# EAGLE board M840X (EAGLE 6.6.0), part 1 of 2
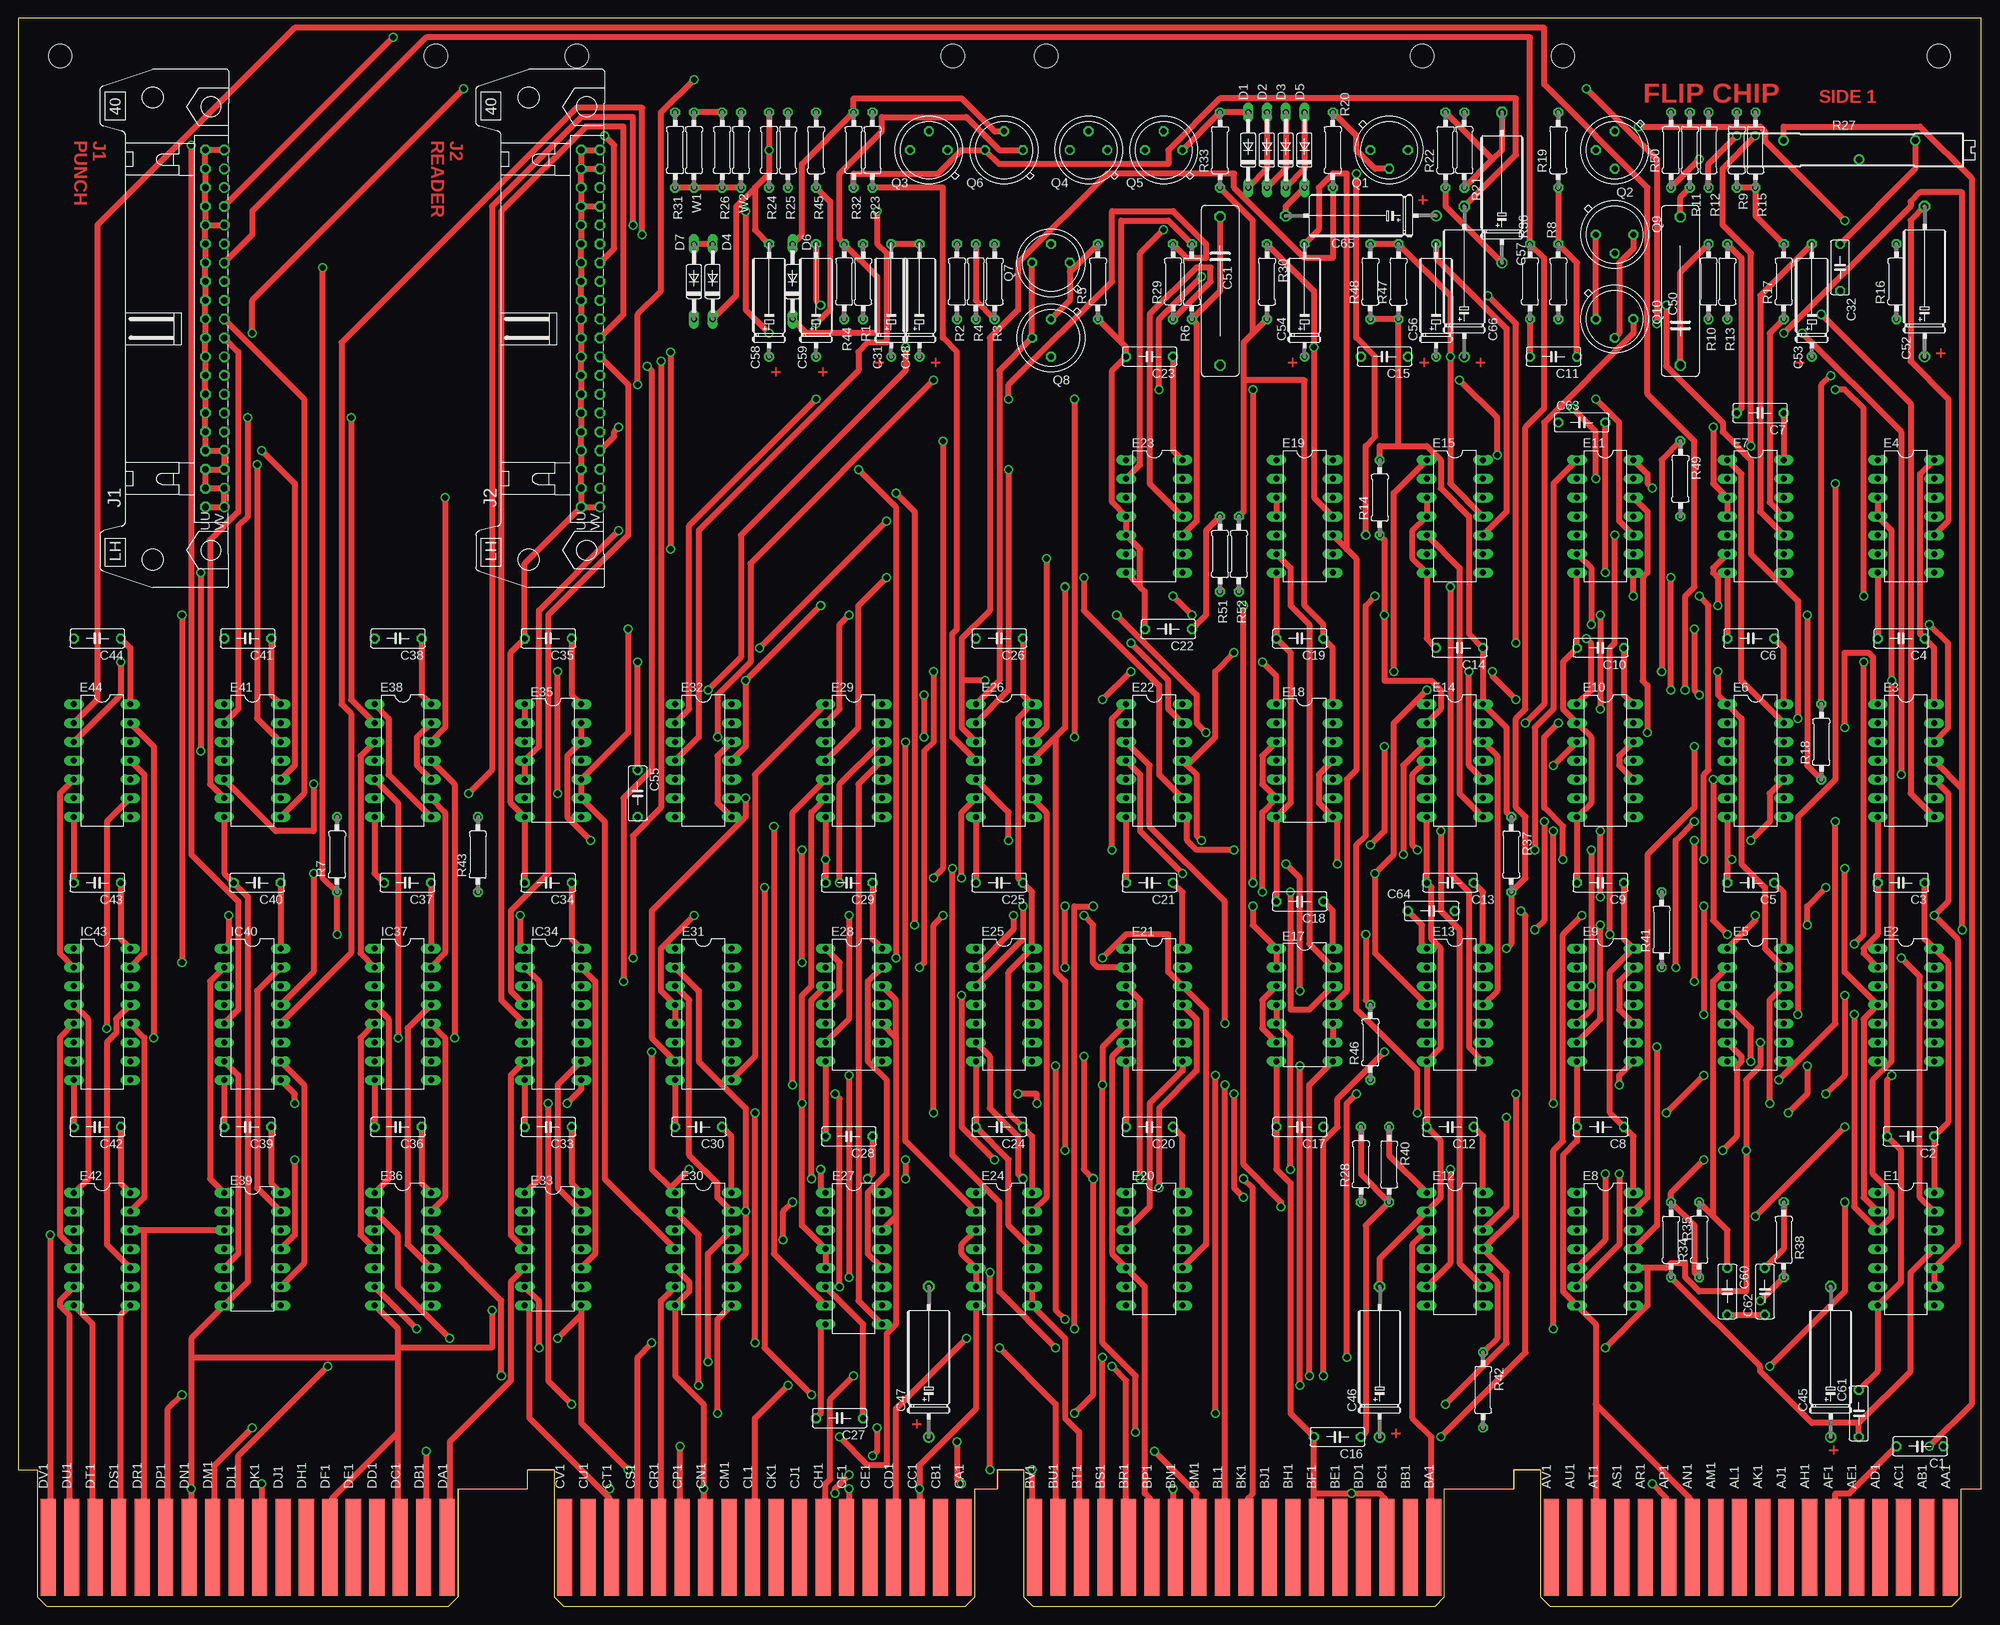
[diagram p4: board, top side]
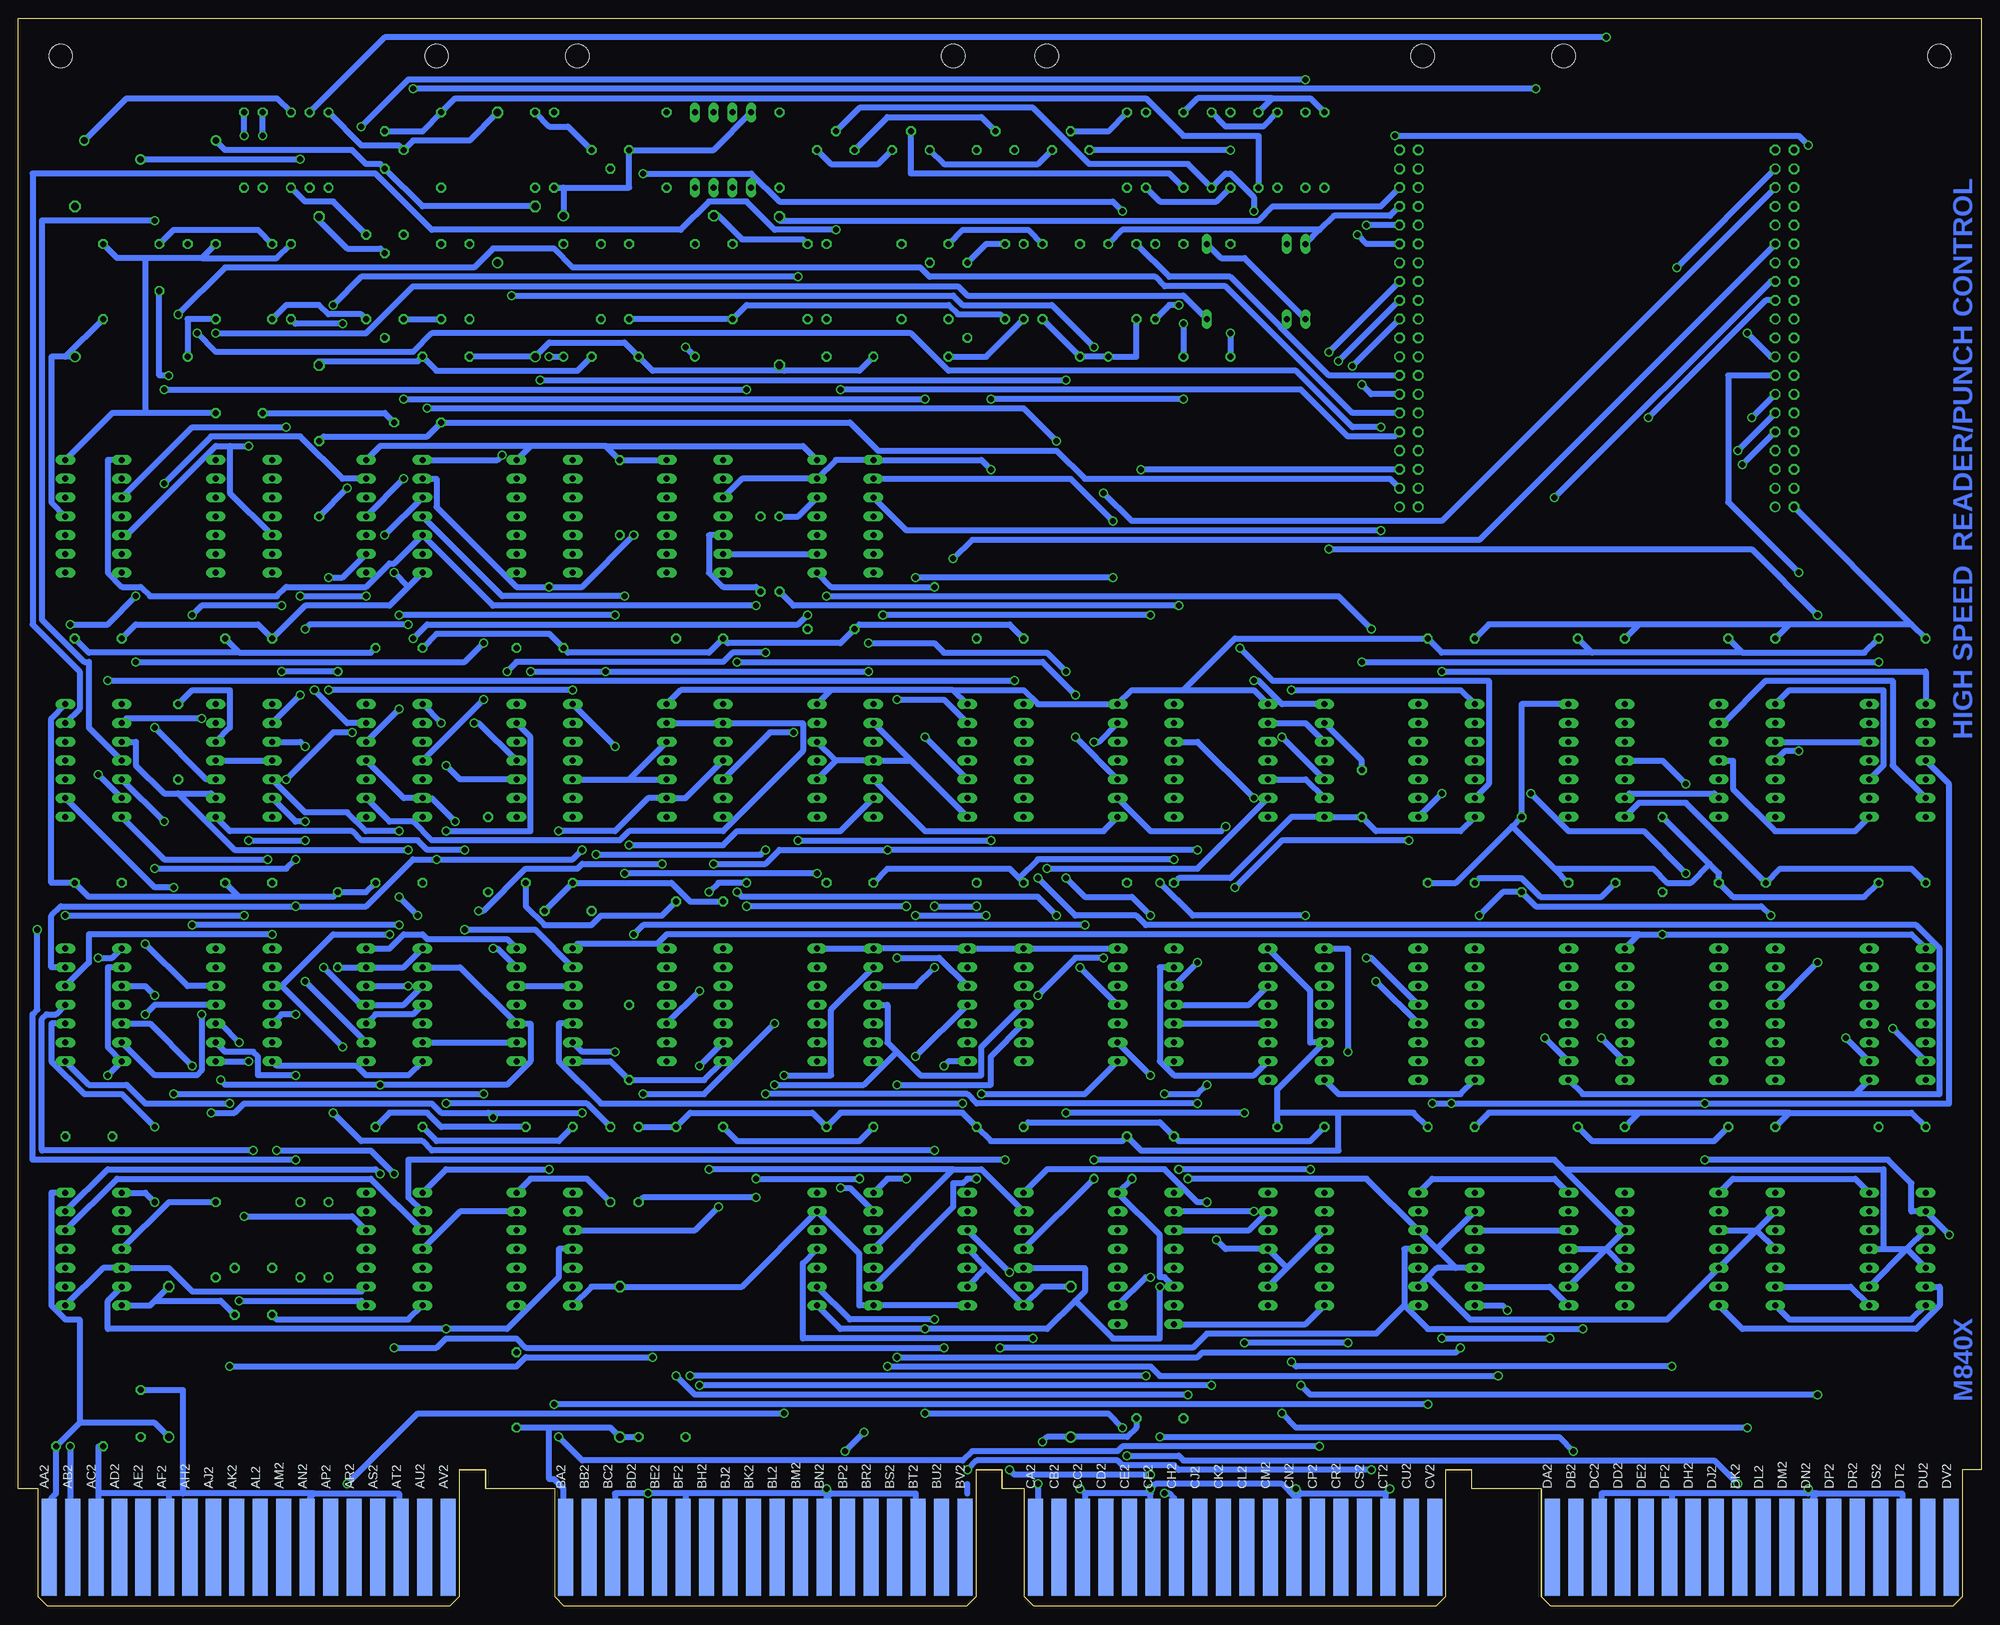
[diagram p5: board, bottom side, seen from below]

Size 265.3 x 214.63 mm. Coordinates in mm from the lower left corner, seen from the top.
Copper layers (1+2+15+16): Top 0.035mm / dielectric 1.5mm / ECO1 0.035mm / dielectric 0.15mm / ECO2 0.035mm / dielectric 0.2mm / Bottom 0.035mm
Design rules "16mils *": minimum track width 16mil, minimum drill 32mil, track to track 15mil, track to pad 10mil, pad to pad 10mil, via to via 10mil, smd to smd 10mil, copper to edge 13mil, drill to drill 10mil, minimum pad ring 10mil, minimum via ring 8mil, stop-mask expansion 0mil, vias tented up to drill 0mil, thermal gap 10mil
Net classes: 0 default: width 0.813 mm; 1 supply: width 0.813 mm

## Footprints (pad centres in the part's own frame; a part is rotated, then mirrored left to right if it is on the bottom)
C063-025X075 = drill 0.813 octagon: 1 -2.54,0; 2 3.81,0
E15-5 = drill 0.813: + -7.62,0 | drill 0.813 octagon: - 7.62,0
E12-8 = drill 1.016: + -10.16,0 | drill 1.016 octagon: - 10.16,0
C203-054-229 = drill 1.016 octagon: 1 -10.033,0; 2 10.033,0
DO35-10 = drill 0.813 long: A 5.08,0; C -5.08,0
DIL14 = drill 0.813 long: 1 -7.62,-3.81; 2 -5.08,-3.81; 3 -2.54,-3.81; 4 0,-3.81; 5 2.54,-3.81; 6 5.08,-3.81; 7 7.62,-3.81; 8 7.62,3.81; 9 5.08,3.81; 10 2.54,3.81; 11 0,3.81; 12 -2.54,3.81; 13 -5.08,3.81; 14 -7.62,3.81
DIL16 = drill 0.813 long: 1 -8.89,-3.81; 2 -6.35,-3.81; 3 -3.81,-3.81; 4 -1.27,-3.81; 5 1.27,-3.81; 6 3.81,-3.81; 7 6.35,-3.81; 8 8.89,-3.81; 9 8.89,3.81; 10 6.35,3.81; 11 3.81,3.81; 12 1.27,3.81; 13 -1.27,3.81; 14 -3.81,3.81; 15 -6.35,3.81; 16 -8.89,3.81
DEC40PINH = drill 0.914 octagon: A 24.13,1.27; AA -3.81,1.27; B 24.13,-1.27; BB -3.81,-1.27; C 21.59,1.27; CC -6.35,1.27; D 21.59,-1.27; DD -6.35,-1.27; E 19.05,1.27; EE -8.89,1.27; F 19.05,-1.27; FF -8.89,-1.27; H 16.51,1.27; HH -11.43,1.27; J 16.51,-1.27; JJ -11.43,-1.27; K 13.97,1.27; KK -13.97,1.27; L 13.97,-1.27; LL -13.97,-1.27; M 11.43,1.27; MM -16.51,1.27; N 11.43,-1.27; NN -16.51,-1.27; P 8.89,1.27; PP -19.05,1.27; R 8.89,-1.27; RR -19.05,-1.27; S 6.35,1.27; SS -21.59,1.27; T 6.35,-1.27; TT -21.59,-1.27; U 3.81,1.27; UU -24.13,1.27; V 3.81,-1.27; W 1.27,1.27; X 1.27,-1.27; Y -1.27,1.27; Z -1.27,-1.27 | drill 0.914: VV -24.13,-1.27
EDGE-CON8 = smd 2.032 x 13.106: AA1 261.303,7.938; AB1 258.127,7.938; AC1 254.952,7.938; AD1 251.778,7.938; AE1 248.602,7.938; AF1 245.428,7.938; AH1 242.252,7.938; AJ1 239.077,7.938; AK1 235.903,7.938; AL1 232.727,7.938; AM1 229.553,7.938; AN1 226.377,7.938; AP1 223.202,7.938; AR1 220.028,7.938; AS1 216.852,7.938; AT1 213.678,7.938; AU1 210.502,7.938; AV1 207.327,7.938; BA1 191.452,7.938; BB1 188.278,7.938; BC1 185.102,7.938; BD1 181.928,7.938; BE1 178.752,7.938; BF1 175.577,7.938; BH1 172.403,7.938; BJ1 169.227,7.938; BK1 166.053,7.938; BL1 162.877,7.938; BM1 159.702,7.938; BN1 156.528,7.938; BP1 153.352,7.938; BR1 150.178,7.938; BS1 147.002,7.938; BT1 143.827,7.938; BU1 140.653,7.938; BV1 137.477,7.938; CA1 127.953,7.938; CB1 124.778,7.938; CC1 121.603,7.938; CD1 118.427,7.938; CE1 115.252,7.938; CF1 112.078,7.938; CH1 108.903,7.938; CJ1 105.728,7.938; CK1 102.552,7.938; CL1 99.377,7.938; CM1 96.203,7.938; CN1 93.028,7.938; CP1 89.853,7.938; CR1 86.677,7.938; CS1 83.502,7.938; CT1 80.328,7.938; CU1 77.153,7.938; CV1 73.978,7.938; DA1 58.102,7.938; DB1 54.928,7.938; DC1 51.752,7.938; DD1 48.578,7.938; DE1 45.403,7.938; DF1 42.227,7.938; DH1 39.053,7.938; DJ1 35.877,7.938; DK1 32.703,7.938; DL1 29.527,7.938; DM1 26.352,7.938; DN1 23.177,7.938; DP1 20.003,7.938; DR1 16.828,7.938; DS1 13.652,7.938; DT1 10.477,7.938; DU1 7.303,7.938; DV1 4.128,7.938 | smd 2.032 x 13.106 bottom: AA2 261.303,7.938; AB2 258.127,7.938; AC2 254.952,7.938; AD2 251.778,7.938; AE2 248.602,7.938; AF2 245.428,7.938; AH2 242.252,7.938; AJ2 239.077,7.938; AK2 235.903,7.938; AL2 232.727,7.938; AM2 229.553,7.938; AN2 226.377,7.938; AP2 223.202,7.938; AR2 220.028,7.938; AS2 216.852,7.938; AT2 213.678,7.938; AU2 210.502,7.938; AV2 207.327,7.938; BA2 191.452,7.938; BB2 188.278,7.938; BC2 185.102,7.938; BD2 181.928,7.938; BE2 178.752,7.938; BF2 175.577,7.938; BH2 172.403,7.938; BJ2 169.227,7.938; BK2 166.053,7.938; BL2 162.877,7.938; BM2 159.702,7.938; BN2 156.528,7.938; BP2 153.352,7.938; BR2 150.178,7.938; BS2 147.002,7.938; BT2 143.827,7.938; BU2 140.653,7.938; BV2 137.477,7.938; CA2 127.953,7.938; CB2 124.778,7.938; CC2 121.603,7.938; CD2 118.427,7.938; CE2 115.252,7.938; CF2 112.078,7.938; CH2 108.903,7.938; CJ2 105.728,7.938; CK2 102.552,7.938; CL2 99.377,7.938; CM2 96.203,7.938; CN2 93.028,7.938; CP2 89.853,7.938; CR2 86.677,7.938; CS2 83.502,7.938; CT2 80.328,7.938; CU2 77.153,7.938; CV2 73.978,7.938; DA2 58.102,7.938; DB2 54.928,7.938; DC2 51.752,7.938; DD2 48.578,7.938; DE2 45.403,7.938; DF2 42.227,7.938; DH2 39.053,7.938; DJ2 35.877,7.938; DK2 32.703,7.938; DL2 29.527,7.938; DM2 26.352,7.938; DN2 23.177,7.938; DP2 20.003,7.938; DR2 16.828,7.938; DS2 13.652,7.938; DT2 10.477,7.938; DU2 7.303,7.938; DV2 4.128,7.938
TO5 = drill 0.813 octagon: 1 0,-2.54; 2 2.54,0; 3 0,2.54
0207/10 = drill 0.813 octagon: 1 -5.08,0; 2 5.08,0
3006Y = drill 0.9: 1 -8.89,1.27; 2 1.27,-1.27; 3 8.89,1.27
OMNIBUS = hole 3.175: 208.915,209.55; 259.715,209.55; 189.865,209.55; 139.065,209.55; 75.616,209.55; 126.416,209.55; 56.566,209.55; 5.766,209.55

## Placement (x,y rotation side)
C1  .01uF  [C063-025X075]  257.68,21.59 180 top
C2  .01uF  [C063-025X075]  256.41,63.5 180 top
C3  .01uF  [C063-025X075]  255.14,97.79 180 top
C4  .01uF  [C063-025X075]  255.14,130.81 180 top
C5  .01uF  [C063-025X075]  234.82,97.79 180 top
C6  .01uF  [C063-025X075]  234.82,130.81 180 top
C7  .01uF  [C063-025X075]  236.09,161.29 180 top
C8  .01uF  [C063-025X075]  214.5,64.77 180 top
C9  .01uF  [C063-025X075]  214.5,97.79 180 top
C10  .01uF  [C063-025X075]  214.5,129.54 180 top
C11  .01uF  [C063-025X075]  208.15,168.91 180 top
C12  .01uF  [C063-025X075]  194.18,64.77 180 top
C13  .01uF  [C063-025X075]  194.18,97.79 180 top
C14  .01uF  [C063-025X075]  195.45,129.54 180 top
C15  .01uF  [C063-025X075]  185.29,168.91 180 top
C16  .01uF  [C063-025X075]  178.94,22.86 180 top
C17  .01uF  [C063-025X075]  173.86,64.77 180 top
C18  .01uF  [C063-025X075]  173.86,95.25 180 top
C19  .01uF  [C063-025X075]  173.86,130.81 180 top
C20  .01uF  [C063-025X075]  153.54,64.77 180 top
C21  .01uF  [C063-025X075]  153.54,97.79 180 top
C22  680pF  [C063-025X075]  156.08,132.08 180 top
C23  .01uF  [C063-025X075]  153.54,168.91 180 top
C24  .01uF  [C063-025X075]  133.22,64.77 180 top
C25  .01uF  [C063-025X075]  133.22,97.79 180 top
C26  .01uF  [C063-025X075]  133.22,130.81 180 top
C27  .01uF  [C063-025X075]  111.63,25.4 180 top
C28  .01uF  [C063-025X075]  112.9,63.5 180 top
C29  .01uF  [C063-025X075]  112.9,97.79 180 top
C30  .01uF  [C063-025X075]  92.58,64.77 180 top
C31  OPEN  [E15-5]  117.98,176.53 90 top
C32  680pF  [C063-025X075]  246.25,180.34 90 top
C33  .01uF  [C063-025X075]  72.26,64.77 180 top
C34  .01uF  [C063-025X075]  72.26,97.79 180 top
C35  .01uF  [C063-025X075]  72.26,130.81 180 top
C36  .01uF  [C063-025X075]  51.94,64.77 180 top
C37  .01uF  [C063-025X075]  53.21,97.79 180 top
C38  .01uF  [C063-025X075]  51.94,130.81 180 top
C39  .01uF  [C063-025X075]  31.62,64.77 180 top
C40  .01uF  [C063-025X075]  32.89,97.79 180 top
C41  .01uF  [C063-025X075]  31.62,130.81 180 top
C42  .01uF  [C063-025X075]  11.3,64.77 180 top
C43  .01uF  [C063-025X075]  11.3,97.79 180 top
C44  .01uF  [C063-025X075]  11.3,130.81 180 top
C45  6.8uF  [E12-8]  244.98,33.02 90 top
C46  6.8uF  [E12-8]  184.02,33.02 90 top
C47  6.8uF  [E12-8]  123.06,33.02 90 top
C48  2.2uF  [E15-5]  121.79,176.53 90 top
C50  .01uF  [C203-054-229]  224.66,177.8 90 top
C51  .01uF  [C203-054-229]  162.43,177.8 270 top
C52  15uF  [E12-8]  257.68,179.07 90 top
C53  1uF  [E15-5]  242.44,176.53 90 top
C54  3.9uF  [E15-5]  173.86,176.53 90 top
C55  2500pF  [C063-025X075]  83.69,110.49 270 top
C56  2.2uF  [E15-5]  191.64,176.53 90 top
C57  6.8uF  [E12-8]  200.53,191.77 90 top
C58  1uF  [E15-5]  101.47,176.53 90 top
C59  1uF  [E15-5]  107.82,176.53 90 top
C60  1000pF  [C063-025X075]  231.01,43.18 270 top
C61  1500pF  [C063-025X075]  248.79,25.4 90 top
C62  680pF  [C063-025X075]  236.09,43.18 270 top
C63  330pF  [C063-025X075]  210.69,160.02 0 top
C64  330pF  [C063-025X075]  190.37,93.98 0 top
C65  39uF  [E12-8]  181.48,187.96 180 top
C66  6.8uF  [E12-8]  195.45,179.07 90 top
D1  1N914  [DO35-10]  166.24,196.85 90 top
D2  1N914  [DO35-10]  168.78,196.85 90 top
D3  1N914  [DO35-10]  171.32,196.85 90 top
D4  1N4154  [DO35-10]  93.85,179.07 90 top
D5  1N914  [DO35-10]  173.86,196.85 90 top
D6  1N4154  [DO35-10]  104.65,179.07 90 top
D7  1N4154  [DO35-10]  91.31,179.07 90 top
E1  7410N  [DIL14]  255.14,48.26 270 top
E2  7474N  [DIL14]  255.14,81.28 270 top
E3  7404N  [DIL14]  255.14,114.3 270 top
E4  74121N  [DIL14]  255.14,147.32 270 top
E5  7400N  [DIL14]  234.82,81.28 270 top
E6  7400N  [DIL14]  234.82,114.3 270 top
E7  74121N  [DIL14]  234.82,147.32 270 top
E8  7404N  [DIL14]  214.5,48.26 270 top
E9  7474N  [DIL14]  214.5,81.28 270 top
E10  7474N  [DIL14]  214.5,114.3 270 top
E11  7410N  [DIL14]  214.5,147.32 270 top
E12  7474N  [DIL14]  194.18,48.26 270 top
E13  7400N  [DIL14]  194.18,81.28 270 top
E14  7474N  [DIL14]  194.18,114.3 270 top
E15  74121N  [DIL14]  194.18,147.32 270 top
E17  7438N  [DIL14]  173.86,81.28 270 top
E18  7438N  [DIL14]  173.86,114.3 270 top
E19  74121N  [DIL14]  173.86,147.32 270 top
E20  74HCT04N  [DIL14]  153.54,48.26 270 top
E21  74HCT30N  [DIL14]  153.54,81.28 270 top
E22  7400N  [DIL14]  153.54,114.3 270 top
E23  7400N  [DIL14]  153.54,147.32 270 top
E24  74HCT02N  [DIL14]  133.22,48.26 270 top
E25  74HCT30N  [DIL14]  133.22,81.28 270 top
E26  7404N  [DIL14]  133.22,114.3 270 top
E27  74LS138N  [DIL16]  112.9,46.99 270 top
E28  7400N  [DIL14]  112.9,81.28 270 top
E29  7404N  [DIL14]  112.9,114.3 270 top
E30  74HCT02N  [DIL14]  92.58,48.26 270 top
E31  74LS138N  [DIL16]  92.58,80.01 270 top
E32  7400N  [DIL14]  92.58,114.3 270 top
E33  7438N  [DIL14]  72.26,48.26 270 top
E35  7420N  [DIL14]  72.26,114.3 270 top
E36  74HCT02N  [DIL14]  51.94,48.26 270 top
E38  7404N  [DIL14]  51.94,114.3 270 top
E39  7438N  [DIL14]  31.62,48.26 270 top
E41  7404N  [DIL14]  31.62,114.3 270 top
E42  74HCT02N  [DIL14]  11.3,48.26 270 top
E44  7404N  [DIL14]  11.3,114.3 270 top
IC34  74175N  [DIL16]  72.26,80.01 270 top
IC37  74175N  [DIL16]  51.94,80.01 270 top
IC40  74175N  [DIL16]  31.62,80.01 270 top
IC43  74175N  [DIL16]  11.3,80.01 270 top
J1  DEC40PINSH  [DEC40PINH]  26.54,172.72 90 top
J2  DEC40PINSH  [DEC40PINH]  77.34,172.72 90 top
OMNIBUS  QUAD  [EDGE-CON8]  -0.13,0 0 top
Q1  MPS6534  [TO5]  185.29,196.85 270 top
Q2  MPS6534  [TO5]  215.77,196.85 180 top
Q3  MPS6534  [TO5]  123.06,196.85 90 top
Q4  MPS6534  [TO5]  144.65,196.85 90 top
Q5  MPS6534  [TO5]  154.81,196.85 90 top
Q6  MPS6534  [TO5]  133.22,196.85 90 top
Q7  MPS6531  [TO5]  139.57,181.61 90 top
Q8  MPS6531  [TO5]  139.57,171.45 180 top
Q9  MPS6534  [TO5]  215.77,185.42 270 top
Q10  MPS6534  [TO5]  215.77,173.99 270 top
R1  220  [0207/10]  114.17,179.07 270 top
R2  4.7K  [0207/10]  126.87,179.07 90 top
R3  4.7K  [0207/10]  131.95,179.07 270 top
R4  220  [0207/10]  129.41,179.07 90 top
R5  100  [0207/10]  145.92,179.07 90 top
R6  220  [0207/10]  158.62,179.07 270 top
R7  3K  [0207/10]  43.05,101.6 90 top
R8  56  [0207/10]  208.15,179.07 90 top
R9  5.6K  [0207/10]  232.28,196.85 270 top
R10  100  [0207/10]  228.47,179.07 90 top
R11  3K  [0207/10]  225.93,196.85 270 top
R12  3K  [0207/10]  228.47,196.85 270 top
R13  150  [0207/10]  231.01,179.07 270 top
R14  3K  [0207/10]  184.02,149.86 90 top
R15  3K  [0207/10]  234.82,196.85 270 top
R16  15K  [0207/10]  253.87,179.07 90 top
R17  1.5K  [0207/10]  238.63,179.07 90 top
R18  220  [0207/10]  243.71,116.84 90 top
R19  3K  [0207/10]  208.15,196.85 270 top
R20  3K  [0207/10]  177.67,196.85 90 top
R21  680  [0207/10]  195.45,196.85 90 top
R22  3K  [0207/10]  192.91,196.85 270 top
R23  3K  [0207/10]  115.44,196.85 90 top
R24  3K  [0207/10]  101.47,196.85 90 top
R25  3K  [0207/10]  104.01,196.85 270 top
R26  3K  [0207/10]  95.12,196.85 90 top
R27  1K  [3006Y]  247.52,196.85 0 top
R28  3K  [0207/10]  181.48,59.69 90 top
R29  100  [0207/10]  156.08,179.07 90 top
R30  10K  [0207/10]  168.78,179.07 270 top
R31  3K  [0207/10]  88.77,196.85 90 top
R32  3K  [0207/10]  112.9,196.85 90 top
R33  47  [0207/10]  162.43,196.85 270 top
R34  220  [0207/10]  227.2,49.53 90 top
R35  330  [0207/10]  223.39,49.53 270 top
R36  10K  [0207/10]  204.34,179.07 90 top
R37  3K  [0207/10]  201.8,101.6 270 top
R38  220  [0207/10]  238.63,49.53 90 top
R40  3K  [0207/10]  185.29,59.69 270 top
R41  3K  [0207/10]  222.12,91.44 90 top
R42  3K  [0207/10]  197.99,29.21 270 top
R43  3K  [0207/10]  62.1,101.6 90 top
R44  75  [0207/10]  111.63,179.07 90 top
R45  3K  [0207/10]  107.82,196.85 270 top
R46  10K  [0207/10]  182.75,76.2 90 top
R47  18K  [0207/10]  186.56,179.07 270 top
R48  OPEN  [0207/10]  182.75,179.07 270 top
R49  270  [0207/10]  224.66,152.4 270 top
R50  1.5K  [0207/10]  223.39,196.85 90 top
R51  220  [0207/10]  162.43,142.24 90 top
R52  3K  [0207/10]  164.97,142.24 90 top
U$1  OUTLINE-OMNIBUS  [OMNIBUS]  -0.13,0 0 top
W1  0  [0207/10]  91.31,196.85 90 top
W2  0  [0207/10]  97.66,196.85 90 top

## Tracks (layer width: path | path; a pad name or v marks a point on that pad's centre or on a via)
!AB  (via drill 0.81)
  Top 0.813: v204.98,102.23 204.98,118.75 207.52,121.28 207.52,151.76 E11.1 | v94.49,117.47 94.49,123.19 98.93,127.64 98.93,140.97 v123.7,165.74 | v194.82,165.74 199.9,160.66 v199.9,155.57
  Bottom 0.813: E6.8 236.73,104.78 220.22,104.78 218.95,103.5 211.33,103.5 210.06,102.23 v204.98,102.23 | v94.49,117.47 E32.5 | v194.82,165.74 v123.7,165.74 | v199.9,155.57 200.53,154.94 E11.1
!BA  (via drill 0.81)
  Top 0.813: v246.89,187.32 236.09,198.12 236.09,199.39 235.46,200.03 v218.95,200.03 | v91.31,206.38 86.87,201.93 86.87,177.8 83.69,174.62 v83.69,165.1
  Bottom 0.813: E3.4 255.78,118.75 255.78,127.64 256.41,127.64 262.13,133.35 262.13,187.32 v246.89,187.32 | v218.95,200.03 212.6,206.38 v91.31,206.38 | v83.69,165.1 82.42,163.83 J2.FF
!BB  (via drill 0.81)
  Top 0.813: v240.54,120.02 240.54,135.89 234.19,142.24 234.19,154.94 230.38,158.75 230.38,160.02 222.76,167.64 v222.76,175.9 | v159.89,179.71 154.18,173.99 v154.18,164.47
  Bottom 0.813: E3.2 250.7,120.02 v240.54,120.02 | v222.76,175.9 218.95,179.71 v159.89,179.71 | v154.18,164.47 91.95,164.47 85.6,158.12 79.25,158.12 J2.LL
!C1  (via drill 0.81)
  Top 0.813: E17.8 174.5,70.48 v174.5,31.11 | v112.9,31.11 109.73,27.94 109.73,17.14 109.09,16.51 109.09,8.26 OMNIBUS.CH1
  Bottom 0.813: v112.9,31.11 v174.5,31.11
!CATCH_PULSE
  Bottom 0.813: E6.11 E6.4
!CLOCK_PULSE  (via drill 0.81)
  Top 0.813: E8.11 221.49,51.44 v221.49,75.56 | v215.77,144.78 215.77,130.18 215.14,129.54 v215.14,90.81
  Bottom 0.813: 229.74,83.82 v221.49,75.56 | E5.3 229.74,83.82 | v215.77,144.78 E11.3 | v215.14,90.81 222.76,90.81 229.74,83.82
!DATA04  (via drill 0.81)
  Top 0.813: E36.12 65.28,41.27 v65.28,31.11 | v147.83,32.38 149.73,30.48 149.73,8.26 OMNIBUS.BR1
  Bottom 0.813: E33.3 E36.12 | v65.28,31.11 111,31.11 112.27,32.38 v147.83,32.38
!DATA05  (via drill 0.81)
  Top 0.813: E33.6 70.36,41.27 v70.36,34.92 | v146.56,33.66 146.56,8.26 OMNIBUS.BS1
  Bottom 0.813: E36.8 58.29,43.18 E33.6 | v70.36,34.92 70.99,34.29 105.28,34.29 105.92,33.66 v146.56,33.66
!DATA06  (via drill 0.81)
  Top 0.813: v53.85,37.47 E36.6 | v132.59,34.92 140.21,27.3 140.21,8.26 OMNIBUS.BU1
  Bottom 0.813: v53.85,37.47 74.8,37.47 77.98,40.64 | 77.98,40.64 77.98,48.26 E33.11 | v132.59,34.92 106.55,34.92 104.65,36.83 81.79,36.83 77.98,40.64
!DATA07  (via drill 0.81)
  Top 0.813: E36.2 51.31,50.16 51.31,43.18 v58.29,36.2 | 76.07,39.37 v72.9,36.2 | E33.8 76.07,39.37 | v137.03,18.41 137.03,8.26 OMNIBUS.BV1 | v82.42,18.41 76.07,24.77 76.07,39.37
  Bottom 0.813: v72.9,36.2 v58.29,36.2 | v137.03,18.41 135.76,19.68 116.71,19.68 116.08,19.05 109.09,19.05 108.46,18.41 v82.42,18.41
!DATA08
  Top 0.813: E39.3 17.02,50.8 | 17.02,50.8 E42.12 | 17.02,50.8 17.02,8.26 OMNIBUS.DR1
!DATA09
  Top 0.813: E42.8 13.84,39.37 13.84,8.26 OMNIBUS.DS1
  Bottom 0.813: E42.8 17.65,43.18 E39.6
!DATA10
  Top 0.813: E42.6 5.59,41.27 5.59,40.64 6.86,39.37 6.86,8.26 OMNIBUS.DU1
  Bottom 0.813: E39.8 32.26,37.47 8.76,37.47 5.59,40.64 5.59,43.18 E42.6
!DATA11  (via drill 0.81)
  Top 0.813: E39.11 37.34,50.16 v37.34,60.33 | v4.32,50.16 4.32,8.26 OMNIBUS.DV1
  Bottom 0.813: v37.34,60.33 12.57,60.33 9.4,57.15 9.4,53.34 E42.2 v4.32,50.16
!ENA_PUN_BUFFR  (via drill 0.81)
  Top 0.813: v119.89,60.33 v119.89,57.78
  Bottom 0.813: 10.03,48.26 E42.5 | E42.11 13.21,48.26 | 13.21,48.26 10.03,48.26 | 10.03,48.26 E42.9 | 10.03,48.26 E42.3 | 50.67,48.26 E36.5 | E36.11 50.67,48.26 | 50.67,48.26 E36.3 56.39,59.05 | 50.67,48.26 E36.9 | v119.89,57.78 E24.4 | v119.89,60.33 57.66,60.33 56.39,59.05 | 13.21,48.26 13.21,59.05 56.39,59.05
!ENABLE
  Top 0.813: R23.1 124.97,191.77 124.97,171.45 126.87,169.54 126.87,132.08 126.24,131.44 126.24,117.47 E26.4
!INIT+EOT  (via drill 0.81)
  Top 0.813: E8.6 216.41,48.9 v216.41,58.42 | v254.51,87.63 257.05,85.09 257.05,55.24 E1.13
  Bottom 0.813: v216.41,58.42 217.04,59.05 253.24,59.05 E1.13 | E2.1 252.6,87.63 v254.51,87.63
!INITIALIZE  (via drill 0.81)
  Top 0.813: E30.4 79.25,57.78 79.25,106.05 E35.9 E35.10 82.42,118.11 v82.42,132.08 | E14.4 188.47,112.39 188.47,102.87 v189.1,102.23 | v227.84,94.61 v227.84,80.01 | v208.15,119.38 206.25,117.47 206.25,107.95 208.79,105.41 v208.79,100.97 | v158.62,133.99 v156.08,136.53 | v211.96,130.81 212.6,130.18 212.6,123.83 E10.1
  Bottom 0.813: v189.1,102.23 190.37,100.97 v208.79,100.97 211.96,100.97 218.31,94.61 v227.84,94.61 259.59,94.61 260.86,93.34 260.86,86.36 E2.13 | E5.5 229.74,80.01 v227.84,80.01 | v208.15,119.38 E10.1 | v82.42,132.08 86.87,136.53 v156.08,136.53 | v158.62,133.99 159.89,132.72 210.06,132.72 v211.96,130.81
!INTERNAL_IO  (via drill 0.81)
  Top 0.813: E17.6 168.15,78.11 168.15,81.92 E17.3 | v173.23,29.84 v173.23,73.03 | v104.01,29.84 99.57,25.4 99.57,8.26 OMNIBUS.CL1
  Bottom 0.813: v173.23,73.03 E17.6 | v104.01,29.84 v173.23,29.84
!INTERRUPT  (via drill 0.81)
  Top 0.813: E18.11 175.77,112.39 175.77,108.58 E18.8 178.31,106.05 v178.31,100.33 | v203.07,93.98 203.71,93.34 203.71,34.29 v192.28,22.86 | v89.41,21.59 89.41,8.26 OMNIBUS.CP1
  Bottom 0.813: v178.31,100.33 189.1,100.33 189.74,99.69 196.72,99.69 202.44,93.98 v203.07,93.98 | v192.28,22.86 189.1,19.68 137.67,19.68 136.4,20.95 116.71,20.95 116.08,21.59 v89.41,21.59
!IOT  (via drill 0.81)
  Top 0.813: v104.65,54.61 103.38,53.34 v103.38,49.53
  Bottom 0.813: E30.3 93.85,45.72 | 93.85,45.72 E30.9 | 93.85,45.72 E30.11 102.11,48.26 v103.38,49.53 | E24.1 126.24,59.05 110.36,59.05 105.92,54.61 v104.65,54.61
!MD3  (via drill 0.81)
  Top 0.813: E25.2 134.49,91.44 v134.49,93.34 | v144.02,93.34 145.29,92.08 145.29,87 145.92,86.36 E21.2 | v161.8,26.04 v161.8,71.75 | v220.85,16.51 222.76,14.61 222.76,8.26 OMNIBUS.AP1
  Bottom 0.813: v144.02,93.34 v134.49,93.34 | E21.2 155.45,80.64 155.45,71.75 v161.8,71.75 | v161.8,26.04 211.33,26.04 v220.85,16.51
!MD4  (via drill 0.81)
  Top 0.813: E25.3 135.76,90.17 v135.76,94.61 | v141.48,86.36 v141.48,94.61 | E21.3 151.64,81.92 v151.64,57.78 | v165.61,57.78 166.88,56.52 166.88,15.24 166.24,14.61 166.24,8.26 OMNIBUS.BK1
  Bottom 0.813: v141.48,94.61 v135.76,94.61 | v141.48,86.36 144.02,83.82 E21.3 | v165.61,57.78 v151.64,57.78
!MD5  (via drill 0.81)
  Top 0.813: v163.07,70.48 163.07,8.26 OMNIBUS.BL1
  Bottom 0.813: E25.4 135.13,75.56 135.13,71.75 143.38,71.75 146.56,74.93 | 146.56,74.93 147.83,76.2 147.83,81.28 E21.4 | 146.56,74.93 151,70.48 v163.07,70.48
!MD6  (via drill 0.81)
  Top 0.813: E21.5 146.56,75.56 v146.56,70.48 146.56,35.56 151,31.11 v151,23.5 | v153.54,20.95 159.26,15.24 159.26,8.26 OMNIBUS.BM1
  Bottom 0.813: E25.5 133.86,74.3 133.86,70.48 v146.56,70.48 | v153.54,20.95 v151,23.5
!MD7
  Top 0.813: E21.6 147.83,74.3 147.83,47.62 E20.5 152.27,43.18 152.27,15.24 152.91,14.61 152.91,8.26 OMNIBUS.BP1
!MD8  (via drill 0.81)
  Top 0.813: v144.02,74.3 144.02,59.05 v145.29,57.78 145.29,28.57 v142.75,26.04 | v32.89,16.51 32.89,8.26 OMNIBUS.DK1 | v115.44,20.32 116.08,20.95 v116.08,24.13
  Bottom 0.813: E20.1 147.83,57.78 v145.29,57.78 | E25.11 v144.02,74.3 | v32.89,16.51 36.07,19.68 107.82,19.68 108.46,20.32 v115.44,20.32 | v116.08,24.13 117.98,26.04 v142.75,26.04
!MD9  (via drill 0.81)
  Top 0.813: E30.12 93.22,47.62 v93.22,33.02 | v41.78,32.38 29.72,20.32 29.72,8.26 OMNIBUS.DL1
  Bottom 0.813: v93.22,33.02 92.58,32.38 v41.78,32.38
!MD10  (via drill 0.81)
  Top 0.813: E30.8 94.49,38.73 v94.49,26.04 | v31.62,24.13 26.54,19.05 26.54,8.26 OMNIBUS.DM1
  Bottom 0.813: v94.49,26.04 92.58,24.13 v31.62,24.13
!MD11  (via drill 0.81)
  Top 0.813: E30.2 91.95,50.16 v91.95,29.84 | v22.1,28.57 20.19,26.67 20.19,8.26 OMNIBUS.DP1
  Bottom 0.813: v91.95,29.84 90.68,28.57 v22.1,28.57
!MOTOR_STOPPING  (via drill 0.81)
  Top 0.813: E12.3 188.47,48.9 188.47,25.4 191.01,22.86 191.01,8.26 OMNIBUS.BA1 | v165.61,135.25 165.61,59.69 170.69,54.61 v170.69,53.98
  Bottom 0.813: E4.1 253.24,154.94 253.24,139.7 251.33,137.79 248.79,137.79 247.52,136.53 230.38,136.53 229.11,137.79 218.31,137.79 215.14,140.97 214.5,140.97 E11.5 201.17,135.25 v165.61,135.25 | v170.69,53.98 173.86,50.8 E12.3
!MULTI_OUT  (via drill 0.81)
  Top 0.813: D6.C 106.55,172.09 116.08,172.09 116.08,179.71 R44.2 111,184.78 111,193.68 116.71,199.39 116.71,201.29 128.14,201.29 132.59,196.85 Q6.1 | R34.1 226.57,45.09 226.57,51.44 R35.1 223.39,55.88 v227.84,60.33 | 262.76,110.49 E3.11 | v262.76,91.44 262.76,110.49 | v238.63,172.09 255.78,189.23 255.78,189.87 257.05,191.13 262.76,191.13 262.76,110.49
  Bottom 0.813: v262.76,91.44 262.76,80.64 263.4,80.01 263.4,60.33 v227.84,60.33 | D6.C 107.82,177.16 137.03,177.16 138.3,178.44 211.96,178.44 218.31,172.09 v238.63,172.09
!PAUSE  (via drill 0.81)
  Top 0.813: v128.14,36.2 118.62,26.67 118.62,8.26 OMNIBUS.CD1
  Bottom 0.813: E20.11 159.26,46.35 159.26,36.2 v128.14,36.2
!PCE  (via drill 0.81)
  Top 0.813: E27.7 102.11,47.62 v102.11,105.41
  Bottom 0.813: v102.11,105.41 102.74,104.78 112.27,104.78 E29.9
!PCF  (via drill 0.81)
  Top 0.813: v112.27,71.75 v112.27,44.45
  Bottom 0.813: E27.10 112.9,44.45 v112.27,44.45 | E28.9 v112.27,71.75
!PPC
  Top 0.813: E27.12 114.81,47.62 114.81,55.88 117.35,58.42 117.35,71.12 114.81,73.66 114.81,84.45 E28.13
!PSF
  Top 0.813: E27.9 113.54,41.27 113.54,111.12 E29.11
!PUNCH_DONE  (via drill 0.81)
  Top 0.813: v150.37,126.36 v146.56,122.56 | v196.09,126.36 196.09,113.67 E14.10 | v207.52,113.67 E10.3 | E15.1 185.93,150.5 v185.93,126.36
  Bottom 0.813: E26.13 140.21,122.56 v146.56,122.56 | v196.09,126.36 v185.93,126.36 v150.37,126.36 | v207.52,113.67 205.61,111.76 E14.10
!PUNCH_FEED  (via drill 0.81)
  Top 0.813: C64.1 189.74,92.08 189.74,89.53 E13.1 | v43.05,90.81 R7.1 41.15,98.42 v41.15,180.97
  Bottom 0.813: IC43.1 9.4,90.81 v43.05,90.81 46.23,90.81 | IC37.1 46.23,90.81 | v41.15,180.97 J1.D | E13.1 189.74,89.53 178.94,89.53 177.67,90.81 46.23,90.81
!PUNCH_STROBE  (via drill 0.81)
  Top 0.813: E26.5 133.86,107.31 v133.86,103.5 | v159.89,103.5 159.26,104.14 159.26,112.39 157.99,113.67 | E22.11 157.99,113.67 | v202.44,122.56 199.26,125.73 v199.26,126.36 | v164.34,128.91 161.8,126.36 161.8,117.47 157.99,113.67
  Bottom 0.813: v159.89,103.5 v133.86,103.5 | v202.44,122.56 E10.4 | v199.26,126.36 197.99,127.64 170.05,127.64 168.78,128.91 v164.34,128.91
!R_FEED_SW  (via drill 0.81)
  Top 0.813: E5.13 236.09,88.9 236.09,97.16 232.92,100.33 232.92,120.02 E6.1 229.74,123.19 v229.74,126.36 | v222.12,126.36 222.12,154.94 R49.1
  Bottom 0.813: R49.1 224.03,158.12 210.06,158.12 C63.1 152.91,160.02 149.1,156.21 124.97,156.21 121.16,152.4 79.88,152.4 J2.TT | v222.12,126.36 v229.74,126.36
!R_OFFLINE
  Top 0.813: E23.10 159.26,146.69 159.26,173.35 R6.2 162.43,177.8 C51.1
  Bottom 0.813: J2.F 81.15,189.23 95.76,189.23 97.66,187.32 162.43,187.32 C51.1
!RBC
  Top 0.813: E28.1 111,87 111,83.19 E28.4
  Bottom 0.813: E31.14 98.93,81.28 E28.4
!RDR_RUN  (via drill 0.81)
  Top 0.813: v240.54,80.01 240.54,106.68 245.62,111.76 v245.62,151.76
  Bottom 0.813: E2.6 246.89,71.75 241.17,71.75 240.54,72.39 v240.54,80.01 | v245.62,151.76 239.27,158.12 227.2,158.12 221.49,152.4 E11.13
!RFC
  Bottom 0.813: E28.5 E31.12
!RIOP2  (via drill 0.81)
  Top 0.813: E22.3 152.91,113.67 152.91,105.41 163.07,95.25 v163.07,78.74 | v180.85,69.22 179.58,67.94 v179.58,33.66 | v236.73,32.38 246.89,42.55 v246.89,54.61
  Bottom 0.813: v163.07,78.74 172.59,69.22 v180.85,69.22 | v179.58,33.66 196.72,33.66 197.99,32.38 v236.73,32.38 | v246.89,54.61 248.16,55.88 E1.1
!RIOP4  (via drill 0.81)
  Top 0.813: E1.2 249.43,55.24 249.43,79.38 E2.4 246.89,85.72 v246.89,99.69 | v218.31,136.53 E11.8 | v227.2,136.53 228.47,135.25 228.47,113.03 227.84,112.39 v227.84,100.97
  Bottom 0.813: v227.2,136.53 v218.31,136.53 | v227.84,100.97 229.11,99.69 v246.89,99.69
!RPE  (via drill 0.81)
  Top 0.813: E31.7 85.6,76.83 85.6,93.98 98.3,106.68 v98.3,109.22
  Bottom 0.813: v98.3,109.22 105.92,116.84 E29.3
!RRB
  Bottom 0.813: E31.10 98.3,71.75 109.09,71.75 111,73.66 111,86.36 E28.2
!RSF
  Top 0.813: E31.9 99.57,74.3 99.57,112.39 E29.1
!SHIFT_PULSE  (via drill 0.81)
  Top 0.813: v213.87,95.89 v213.87,104.78 | v211.33,93.34 208.79,90.81 208.79,62.87 207.52,61.59 v207.52,37.47
  Bottom 0.813: E1.6 253.24,41.27 253.24,37.47 v207.52,37.47 199.26,37.47 192.28,44.45 192.28,48.26 E12.4 | E6.5 226.57,107.31 220.85,107.31 218.31,104.78 v213.87,104.78 | v211.33,93.34 v213.87,95.89
!SKIP  (via drill 0.81)
  Top 0.813: E18.3 168.15,114.94 168.15,111.12 E18.6 168.15,107.31 v168.15,96.52 | v124.97,93.34 123.7,92.08 v123.7,66.67 | v99.57,35.56 v99.57,66.67 | v85.6,35.56 83.69,33.66 83.69,8.26 OMNIBUS.CS1
  Bottom 0.813: v168.15,96.52 167.51,95.89 127.51,95.89 v124.97,93.34 | v99.57,66.67 v123.7,66.67 | v85.6,35.56 v99.57,35.56
+3V3
  Top 0.813: D1.A R33.1 Q5.1 | C57.+ 192.91,189.23 R22.2
  Bottom 0.813: Q4.1 149.1,194.94 155.45,194.94 Q5.1 | R22.2 191.64,191.77 | 191.64,191.77 182.75,191.77 Q1.1 171.32,196.85 D1.A | 191.64,191.77 C65.+
+3VR40  (via drill 0.81)
  Top 0.813: E12.1 185.29,60.96 R40.1 | v207.52,67.94 v207.52,104.78
  Bottom 0.813: E14.13 196.09,117.47 196.09,104.78 v207.52,104.78 | v207.52,67.94 188.47,67.94 R40.1
-15V  (via drill 0.81)
  Top 0.813: R32.1 112.9,193.68 124.33,193.68 127.51,196.85 Q6.3 132.59,194.94 155.45,194.94 155.45,196.85 162.43,203.84 202.44,203.84 202.44,196.22 C66.- | v258.32,21.59 264.03,27.3 264.03,193.04 257.05,200.03 238.63,200.03 R27.1
  Bottom 0.813: R24.1 103.38,189.87 111,189.87 R32.1 | C66.- 210.69,189.23 Q2.3 216.41,194.94 218.31,194.94 220.22,196.85 237.36,196.85 R27.1 | v258.32,21.59 258.32,8.26 OMNIBUS.AB2
A+B  (via drill 0.81)
  Top 0.813: E13.8 196.09,75.56 196.09,96.52 193.55,99.06 v193.55,137.79 | E32.4 91.95,117.47 91.95,145.41 113.54,167 113.54,169.54 114.81,170.81 117.35,170.81 117.35,182.88 116.08,184.15 v116.08,188.59 | v180.85,193.68 180.85,171.45 183.39,168.91 183.39,158.12 182.12,156.84 v182.12,144.78
  Bottom 0.813: E11.2 208.79,152.4 208.79,148.59 197.99,137.79 v193.55,137.79 189.1,137.79 v182.12,144.78 | v116.08,188.59 117.35,189.87 162.43,189.87 166.24,193.68 v180.85,193.68
BA  (via drill 0.81)
  Top 0.813: E3.8 255.78,109.86 255.78,162.56 v243.71,174.62
  Bottom 0.813: v243.71,174.62 237.36,180.97 203.71,180.97 201.17,183.51 192.91,183.51 190.37,180.97 143.38,180.97 142.11,179.71 111.63,179.71 110.36,178.44 102.11,178.44 84.96,161.29 J2.JJ
BB  (via drill 0.81)
  Top 0.813: v254.51,112.39 254.51,158.75 v241.17,172.09 | v81.15,159.38 80.52,158.75 80.52,158.12 J2.NN
  Bottom 0.813: v254.51,112.39 E3.6 | v241.17,172.09 238.63,169.54 211.96,169.54 209.42,172.09 144.65,172.09 139.57,167 92.58,167 84.96,159.38 v81.15,159.38
BTP3  (via drill 0.81)
  Top 0.813: E13.4 183.39,88.27 v183.39,99.06 185.93,101.6 185.93,119.38 v190.37,123.83 | v157.35,99.06 151.64,104.78 151.64,112.39 E22.4 | v223.39,123.83 v223.39,139.06
  Bottom 0.813: 144.65,114.3 E26.8 | 144.65,114.3 E22.4 154.81,114.3 | v157.35,99.06 v183.39,99.06 | 144.65,114.3 E22.2 | 154.81,114.3 E22.10 | 154.81,114.3 E22.12 | E11.9 221.49,139.06 v223.39,139.06 | v190.37,123.83 v223.39,123.83
CLOCK_PULSE  (via drill 0.81)
  Top 0.813: 220.22,45.72 222.76,45.72 223.39,46.35 225.3,46.35 225.3,44.45 227.2,42.55 233.55,42.55 v233.55,61.59 233.55,71.12 235.46,73.03 v235.46,76.2 | 220.22,45.72 E8.10 | v126.24,99.69 126.24,60.96 132.59,54.61 132.59,42.55 v140.21,34.92 | v214.5,34.92 220.22,40.64 220.22,45.72
  Bottom 0.813: v235.46,76.2 238,78.74 E5.10 | E2.11 260.22,80.01 261.49,80.01 262.13,79.38 262.13,61.59 v233.55,61.59 | E32.9 105.92,99.69 v126.24,99.69 | v140.21,34.92 196.72,34.92 197.99,36.2 207.52,36.2 208.79,34.92 v214.5,34.92
COIL_BIAS  (via drill 0.81)
  Top 0.813: v221.49,173.35 221.49,195.58 v211.96,205.1 | v60.2,205.1 31.62,176.53 v31.62,172.09
  Bottom 0.813: R10.1 227.84,173.35 v221.49,173.35 | v60.2,205.1 v211.96,205.1 | v31.62,172.09 28.45,168.91 J1.BB
ENABLE  (via drill 0.81)
  Top 0.813: E26.3 127.51,118.75 127.51,125.09 | 127.51,125.09 127.51,130.81 131.32,134.62 131.32,171.45 135.13,175.26 135.13,181.61 147.19,193.68 164.34,193.68 164.34,191.77 173.86,182.25 177.67,182.25 R20.1 | E7.4 E7.3 229.11,151.76 v229.11,159.38 | E4.3 E4.4 253.24,145.41 v253.24,125.09 253.24,73.66 250.7,71.12 250.7,58.42 253.24,55.88 253.24,52.7 E1.3 248.16,53.98 v248.16,80.01 | v130.68,125.09 127.51,125.09
  Bottom 0.813: v229.11,159.38 241.81,159.38 E4.3 | v248.16,80.01 246.89,81.28 E5.11 | v253.24,125.09 v130.68,125.09
FEED_HOLE
  Bottom 0.813: R1.1 109.73,179.71 101.47,179.71 88.14,166.37 J2.DD
GND  (via drill 0.81)
  Top 0.813: J2.UU J2.SS J2.PP J2.MM J2.KK J2.HH J2.EE J2.CC J2.AA J2.Y J2.W J2.U J2.S J2.P J2.M J2.K J2.H | J2.UU J2.VV | J2.C J2.A J2.B | J2.C J2.D | C48.- C31.- | D4.A D7.A | J2.H J2.E J2.C | J2.H J2.J | J1.B J1.A J1.C J1.E J1.H J1.K | J1.K J1.L | J1.K J1.M J1.P J1.S J1.U J1.W J1.Y J1.AA J1.CC J1.EE J1.HH J1.KK J1.MM J1.NN J1.RR J1.PP J1.SS J1.TT J1.VV J1.UU | J2.UU 68.45,140.97 C35.2 66.55,128.91 66.55,108.58 E35.7 C34.2 | E36.7 51.31,37.47 51.31,34.92 | 51.31,23.5 51.31,8.26 OMNIBUS.DC1 | 51.31,23.5 51.31,33.66 | 51.31,33.66 51.31,34.92 | 51.31,23.5 42.42,14.61 42.42,8.26 OMNIBUS.DF2 | E42.7 10.03,38.1 10.03,8.26 OMNIBUS.DT2 | 23.37,33.66 23.37,36.2 E39.7 30.99,43.81 30.99,95.89 C40.2 27.81,99.06 E41.7 | 23.37,33.66 v23.37,15.88 23.37,8.26 OMNIBUS.DN2 | 23.37,33.66 51.31,33.66 | C37.2 48.13,99.06 E38.7 | E44.7 C43.2 | E26.7 C25.2 | E22.7 C21.2 | E29.7 v109.09,100.97 C29.2 | C32.2 256.41,194.31 R27.3 | C7.2 232.92,161.93 232.92,182.25 R13.1 | E7.7 C6.2 | E4.7 C4.2 | E15.3 E15.4 188.47,145.41 188.47,141.6 E15.7 190.37,130.81 C14.2 | C9.2 E10.7 212.6,108.58 212.6,117.47 E10.2 208.79,121.28 208.79,127.64 C10.2 E11.7 | v214.5,139.7 C63.2 | R36.1 C11.2 | D5.C 171.32,189.23 C65.- | 149.1,170.81 149.73,170.18 C23.2 147.83,167 147.83,149.22 E23.4 E23.5 151.64,142.88 151.64,137.79 | 149.1,170.81 R5.1 | R6.1 155.45,187.32 149.1,187.32 149.1,170.81 | C18.2 E18.7 171.96,108.58 171.96,128.91 C19.2 E19.7 | E14.7 C13.2 191.01,97.16 191.01,90.17 192.28,88.9 192.28,75.56 E13.7 C12.2 192.28,62.87 192.28,55.24 E12.2 184.02,46.99 C46.- | 151.64,137.79 152.27,137.16 C22.2 | 151.64,137.79 E23.7 | E30.5 90.68,43.81 90.68,42.55 E30.7 88.77,31.11 92.58,27.3 v92.58,15.88 92.58,8.26 OMNIBUS.CN1
  Top 0.813: C27.2 108.46,26.04 108.46,37.47 E27.8 | E33.7 69.09,40.01 69.09,25.4 79.25,15.24 | 79.25,15.24 79.88,14.61 79.88,8.26 OMNIBUS.CT2 | v112.27,15.88 112.27,8.26 OMNIBUS.CF1 | v79.88,15.88 79.25,15.24 | E24.9 E24.8 141.48,36.2 141.48,25.4 143.38,23.5 143.38,8.26 OMNIBUS.BT2 | IC34.8 C33.2 | IC37.8 C36.2 | IC43.8 C42.2 | IC40.8 C39.2 | E31.8 C30.2 | E28.7 C28.2 | E25.7 C24.2 133.86,60.33 133.86,51.44 E24.11 | E24.7 129.41,26.67 121.79,19.05 v121.79,15.88 121.79,8.26 OMNIBUS.CC1 | C1.2 247.52,15.24 245.62,15.24 245.62,8.26 OMNIBUS.AF2 | E6.7 231.01,100.97 | 231.01,100.97 C5.2 | E3.7 C3.2 251.33,90.81 249.43,88.9 249.43,88.27 E2.2 | v231.65,100.97 231.01,100.97 | C60.2 C62.2 | C61.2 251.33,31.75 E1.7 254.51,43.81 254.51,61.59 C2.2 252.6,71.12 v253.24,71.75 | 213.23,27.3 213.23,38.1 E8.7 208.79,42.55 208.79,60.96 210.69,62.87 C8.2 E9.7 | 213.23,27.3 213.23,8.26 OMNIBUS.AT2 | 213.23,27.3 225.93,14.61 225.93,8.26 OMNIBUS.AN2 | 175.13,15.24 175.13,8.26 OMNIBUS.BF2 | 175.13,15.24 C16.2 171.96,26.04 171.96,57.15 170.05,59.05 C17.2 E17.7 | 175.13,15.24 v180.21,15.24 184.02,15.24 184.66,14.61 184.66,8.26 OMNIBUS.BC1 | v156.08,15.88 156.08,8.26 OMNIBUS.BN2 | E21.7 C20.2 | 51.31,34.92 64.01,34.92 v64.01,40.01
  Bottom 0.813: 89.41,186.06 87.5,187.96 79.88,187.96 J2.J | 89.41,186.06 D7.A | C31.- 116.08,186.06 89.41,186.06 | J1.UU 9.4,132.72 | 9.4,132.72 C44.2 | 25.91,132.72 C41.2 | 9.4,132.72 25.91,132.72 | 46.23,132.72 C38.2 | 25.91,132.72 46.23,132.72 | C35.2 66.55,132.72 46.23,132.72 | 22.1,15.24 10.67,15.24 10.67,8.26 OMNIBUS.DT2 | 22.1,15.24 22.73,14.61 22.73,8.26 OMNIBUS.DN2 | 41.78,15.24 41.78,8.26 OMNIBUS.DF2 | 22.1,15.24 23.37,15.24 | 23.37,15.24 41.78,15.24 | 41.78,15.24 51.31,15.24 51.31,8.26 OMNIBUS.DC1 | E42.7 9.4,38.73 25.91,38.73 E39.7 | v23.37,15.88 23.37,15.24 | C43.2 9.4,99.69 27.18,99.69 C40.2 39.88,108.58 46.23,108.58 E38.7 | 130.05,98.42 131.32,99.69 147.83,99.69 C21.2 | 130.05,98.42 C25.2 | E35.7 70.36,104.78 81.79,104.78 C55.2 E32.7 93.22,106.68 101.47,98.42 108.46,98.42 C29.2 | 130.05,98.42 127.51,100.97 v109.09,100.97 | C37.2 51.31,95.89 59.56,95.89 62.1,98.42 67.82,98.42 C34.2 | C63.2 215.77,161.29 C7.2 | R13.1 232.92,186.06 244.35,186.06 C32.2 | R12.1 230.38,203.84 250.7,203.84 R27.3 | C4.2 249.43,132.72 232.92,132.72 C6.2 226.57,135.25 215.14,135.25 212.6,137.79 | C10.2 208.79,131.44 193.55,131.44 C14.2 191.01,128.91 171.96,128.91 C19.2 169.42,130.18 154.18,130.18 C22.2 151.64,132.72 131.32,132.72 C26.2 | E11.7 212.6,137.79 | 212.6,137.79 v214.5,139.7 | C11.2 C66.+ 193.55,170.81 183.39,170.81 C15.2 179.58,167 161.8,167 | R6.1 159.26,184.78 167.51,184.78 170.69,187.96 C65.- | 161.8,167 162.43,167.64 C51.2 | 161.8,167 151.64,167 C23.2 | C64.2 C13.2 177.04,97.79 174.5,95.25 C18.2 | E30.7 91.31,38.1 E27.8 | 112.27,15.24 112.27,8.26 OMNIBUS.CF1 | 112.27,15.24 v112.27,15.88 111.63,16.51 94.49,16.51 92.58,14.61
  Bottom 0.813: 80.52,15.24 80.52,8.26 OMNIBUS.CT2 | 91.95,15.24 80.52,15.24 | 92.58,14.61 91.95,15.24 | 92.58,14.61 92.58,8.26 OMNIBUS.CN1 | 121.16,15.24 121.16,8.26 OMNIBUS.CC1 | 112.27,15.24 121.16,15.24 | 80.52,15.24 v79.88,15.88 | 91.95,15.24 v92.58,15.88 | E24.8 E20.7 151.64,40.64 151.64,47.62 E20.13 167.51,43.18 C46.- 187.83,43.18 E12.7 | C42.2 9.4,66.67 25.91,66.67 | C39.2 25.91,66.67 | 46.23,66.67 C36.2 | 25.91,66.67 46.23,66.67 | C33.2 66.55,66.67 46.23,66.67 | C30.2 90.68,62.87 108.46,62.87 C28.2 111,65.41 128.78,65.41 C24.2 | C47.- 126.87,43.18 E24.7 134.49,45.72 | 134.49,45.72 E24.11 | IC34.8 70.36,69.22 86.87,69.22 E31.8 | 134.49,45.72 E24.9 | v121.79,15.88 121.16,15.24 | 254.51,15.24 254.51,21.59 C1.2 | 254.51,15.24 254.51,8.26 OMNIBUS.AC2 | 225.3,15.24 213.87,15.24 213.87,8.26 OMNIBUS.AT2 | 225.3,15.24 225.93,14.61 225.93,8.26 OMNIBUS.AN2 | 244.98,15.24 244.98,8.26 OMNIBUS.AF2 | 225.3,15.24 243.08,15.24 | 243.08,15.24 244.98,15.24 | 244.98,15.24 254.51,15.24 | E2.2 253.24,86.36 253.24,75.56 E2.7 v253.24,71.75 | v231.65,100.97 245.62,100.97 E3.7 | E8.7 212.6,38.73 230.38,38.73 C60.2 | 246.89,41.27 247.52,40.64 E1.7 | 246.89,41.27 C45.- | C62.2 238,41.27 246.89,41.27 | 243.08,15.24 243.08,29.21 C61.2 | 155.45,15.24 144.02,15.24 144.02,8.26 OMNIBUS.BT2 | 155.45,15.24 156.08,14.61 156.08,8.26 OMNIBUS.BN2 | 155.45,15.24 v156.08,15.88 | 175.13,15.24 175.13,8.26 OMNIBUS.BF2 | 155.45,15.24 175.13,15.24 | 175.13,15.24 v180.21,15.24 184.66,15.24 184.66,8.26 OMNIBUS.BC1 | C20.2 151.64,62.87 168.15,62.87 C17.2 | E5.7 230.38,73.03 219.58,73.03 218.31,71.75 212.6,71.75 E9.7 | E13.7 185.29,73.66 R46.1 172.59,71.12 E17.7
  Bottom 0.813: C8.2 208.79,62.87 192.28,62.87 C12.2 | v64.01,40.01 64.64,40.64 E33.7
HAVE_TAPE  (via drill 0.81)
  Top 0.813: v142.75,163.19 v142.75,117.47 | v213.23,163.19 216.41,160.02 216.41,146.69 E11.10
  Bottom 0.813: v142.75,117.47 E26.10 | v213.23,163.19 v142.75,163.19
INITIALIZE
  Top 0.813: E30.6 86.87,41.27 86.87,8.26 OMNIBUS.CR1
INT_ENA
  Bottom 0.813: E14.5 182.75,111.76 | 182.75,111.76 E18.10 | 182.75,111.76 E18.12
IOT01  (via drill 0.81)
  Top 0.813: E17.4 E17.5 171.96,76.83 v171.96,59.05 | v119.89,116.84 119.89,62.87 E24.2
  Bottom 0.813: E24.2 135.13,59.05 138.94,59.05 | E20.4 138.94,59.05 | E29.13 119.25,116.84 v119.89,116.84 | 138.94,59.05 v171.96,59.05
IOT02  (via drill 0.81)
  Top 0.813: E17.2 E17.1 166.88,92.08 v166.88,94.61 | E24.6 E24.5 127.51,47.62 127.51,48.9 E24.3 | E29.5 104.65,107.31 v104.65,70.48 | v110.36,69.22 111,68.58 v111,43.18 | v145.29,94.61 142.75,94.61 v142.75,37.47
  Bottom 0.813: E20.8 154.18,37.47 v142.75,37.47 126.24,37.47 122.43,41.27 | 122.43,41.27 121.16,42.55 121.16,45.72 E24.5 | v104.65,70.48 105.92,69.22 v110.36,69.22 | v111,43.18 111,36.2 117.35,36.2 122.43,41.27 | v145.29,94.61 v166.88,94.61
MD7  (via drill 0.81)
  Top 0.813: v135.76,57.78 135.13,58.42 135.13,63.5 131.32,67.31 131.32,74.3 E25.6
  Bottom 0.813: E20.6 138.94,53.98 138.94,57.15 137.67,57.15 137.03,57.78 v135.76,57.78
MD8  (via drill 0.81)
  Top 0.813: v154.18,56.52 154.18,67.31 159.26,72.39 159.26,79.38 E21.11
  Bottom 0.813: E20.2 152.91,56.52 v154.18,56.52
MOTOR_POWER  (via drill 0.81)
  Top 0.813: v131.95,60.33 127.51,64.77 v127.51,82.55 | v118.62,87.63 118.62,148.59 v113.54,153.67
  Bottom 0.813: E8.2 212.6,55.24 212.6,60.33 v131.95,60.33 | v127.51,82.55 122.43,87.63 v118.62,87.63 | J2.RR v113.54,153.67
N$1
  Top 0.813: E24.13 138.94,55.24 138.94,107.31 E26.9
N$2
  Bottom 0.813: R1.2 114.17,168.91 C31.+ C48.+ R2.1
N$3
  Top 0.813: Q8.1 142.11,176.53 142.11,180.34 | Q7.1 142.11,180.34 | 142.11,180.34 R5.2
N$4
  Top 0.813: E31.3 90.68,81.92 90.68,60.96 94.49,57.15 94.49,55.24 E30.13
  Bottom 0.813: E30.13 98.93,50.8 E27.3
N$5  (via drill 0.81)
  Top 0.813: R18.1 241.81,113.67 v241.81,133.99 | v229.74,135.25 229.74,139.06 229.11,139.7 229.11,140.34 E7.6
  Bottom 0.813: v241.81,133.99 240.54,135.25 v229.74,135.25
N$7
  Top 0.813: E26.1 132.59,125.09 132.59,167 Q8.2 Q7.3
  Bottom 0.813: Q7.3 134.49,184.15 R3.1
N$8
  Bottom 0.813: R2.2 128.78,186.06 137.67,186.06 Q7.2
N$9
  Bottom 0.813: R4.1 134.49,168.91 Q8.3
N$10
  Top 0.813: E4.10 260.86,146.69 260.86,163.19 255.78,168.28 255.78,187.32 C52.-
N$11
  Top 0.813: Q10.1 Q9.1
  Bottom 0.813: Q10.1 R8.1
N$13
  Top 0.813: R11.2 224.66,190.5 C50.2
  Bottom 0.813: Q9.2 216.41,183.51 220.85,183.51 224.66,187.32 C50.2
N$16  (via drill 0.81)
  Top 0.813: E31.5 E31.4 86.87,83.19 86.87,88.9 v91.31,93.34 | E29.12 111,111.12 v111,97.79
  Bottom 0.813: v111,97.79 106.55,93.34 v91.31,93.34
N$18  (via drill 0.81)
  Top 0.813: E27.5 E27.4 105.92,51.44 v105.92,67.94 105.92,82.55 107.19,83.82 107.19,107.31 E29.6 | v165.61,55.24 164.34,56.52 v164.34,69.22
  Bottom 0.813: R28.1 180.85,55.24 v165.61,55.24 | v164.34,69.22 137.03,69.22 135.76,67.94 v105.92,67.94
N$19  (via drill 0.81)
  Top 0.813: E30.10 98.3,47.62 v98.3,53.34 98.3,67.31 91.95,73.66 91.95,83.19 E31.2
  Bottom 0.813: v98.3,53.34 E27.2
N$20  (via drill 0.81)
  Top 0.813: 88.14,56.52 85.6,59.05 v85.6,74.93 | 88.14,56.52 E30.1 | E27.1 108.46,56.52 v108.46,59.05 | 88.14,56.52 v90.68,59.05
  Bottom 0.813: v85.6,74.93 85.6,88.9 E31.1 | v90.68,59.05 v108.46,59.05
N$21  (via drill 0.81)
  Top 0.813: Q10.2 216.41,172.09 216.41,181.61 218.31,183.51 Q9.3 | v232.28,198.75 228.47,194.94 R12.2
  Bottom 0.813: R12.2 226.57,189.87 222.76,189.87 Q9.3 | v232.28,198.75 R9.1
N$22  (via drill 0.81)
  Top 0.813: v203.71,119.38 206.25,121.92 206.25,160.02 218.31,172.09 Q10.3
  Bottom 0.813: E14.11 203.07,119.38 v203.71,119.38 | R13.2 229.11,175.9 224.66,175.9 223.39,174.62 218.95,174.62 Q10.3
N$23  (via drill 0.81)
  Top 0.813: E12.9 194.82,46.35 194.82,91.44 192.28,93.98 v192.28,104.78
  Bottom 0.813: E18.4 175.13,109.22 E18.9 180.21,109.22 184.66,104.78 v192.28,104.78
N$24
  Top 0.813: E33.1 70.36,57.78 70.36,84.45 IC34.2
N$25  (via drill 0.81)
  Top 0.813: E28.6 112.27,79.38 v112.27,93.34 | v123.7,98.42 124.97,99.69 v124.97,157.48 | v210.06,161.93 213.23,158.75 v213.23,152.4
  Bottom 0.813: v112.27,93.34 114.81,95.89 121.16,95.89 v123.7,98.42 | v124.97,157.48 129.41,161.93 v210.06,161.93 | E11.11 v213.23,152.4
N$26
  Top 0.813: E33.4 66.55,50.16 66.55,71.75 IC34.7
N$27
  Top 0.813: E33.13 72.9,56.52 72.9,70.48 IC34.10
N$28
  Top 0.813: E33.10 77.98,47.62 77.98,84.45 IC34.15
N$29
  Top 0.813: E39.1 25.91,57.78 25.91,84.45 IC40.2
N$30
  Top 0.813: E39.5 29.72,47.62 29.72,71.75 IC40.7
N$31
  Top 0.813: E39.9 38.61,46.35 38.61,70.48 IC40.10
N$32
  Top 0.813: E39.13 32.26,56.52 32.26,83.19 IC40.15
N$33
  Top 0.813: R42.1 199.9,36.2 199.9,43.81 E12.10
N$34  (via drill 0.81)
  Top 0.813: IC40.1 28.45,89.53 v28.45,93.34 | IC34.1 67.82,89.53 v67.82,93.34
  Bottom 0.813: v28.45,93.34 29.72,94.61 60.2,94.61 R43.1 64.64,96.52 v67.82,93.34
N$35  (via drill 0.81)
  Top 0.813: E5.4 234.19,78.11 v234.19,73.66
  Bottom 0.813: E5.8 v234.19,73.66
N$36
  Top 0.813: E42.1 9.4,57.78 9.4,79.38 IC43.4
N$38
  Top 0.813: D3.C 173.86,194.31 D5.A
N$39
  Top 0.813: E42.4 5.59,50.16 5.59,76.83 IC43.5
N$40
  Top 0.813: E42.10 11.94,48.9 11.94,76.2 13.21,77.47 13.21,79.38 IC43.13
N$41
  Top 0.813: E42.13 17.02,55.24 17.02,76.83 IC43.12
N$42
  Top 0.813: E36.13 57.66,55.24 57.66,76.83 IC37.12
N$43
  Top 0.813: E36.10 52.58,48.9 52.58,78.11 IC37.13
N$44
  Top 0.813: D2.C 171.32,194.31 D3.A
N$45
  Top 0.813: R26.2 W1.2
  Bottom 0.813: R25.1 102.11,200.03 97.03,200.03 R26.2
N$46
  Top 0.813: E36.4 46.23,50.16 46.23,76.83 IC37.5
N$47  (via drill 0.81)
  Top 0.813: E9.8 216.41,71.75 v216.41,70.48 | v245.62,106.05 245.62,78.74 v238,71.12
  Bottom 0.813: E9.2 205.61,86.36 E13.10 196.09,78.74 196.09,73.66 199.26,70.48 v216.41,70.48 237.36,70.48 v238,71.12 | v245.62,106.05 E3.5
N$48  (via drill 0.81)
  Top 0.813: v226.57,103.5 v226.57,84.45 | v234.19,103.5 236.73,106.05 236.73,109.86 E6.10 | E3.1 250.7,122.56 250.7,128.27 250.06,128.91 246.89,128.91 v246.89,118.75
  Bottom 0.813: v226.57,84.45 E9.9 | v234.19,103.5 v226.57,103.5 | v246.89,118.75 239.9,111.76 E6.10
N$49  (via drill 0.81)
  Top 0.813: E9.5 212.6,80.64 v212.6,83.82 v212.6,102.23
  Bottom 0.813: E9.12 v212.6,83.82 | E6.9 239.27,109.86 243.71,109.86 | 243.71,109.86 245.62,109.86 249.43,113.67 249.43,116.84 E3.3 | v212.6,102.23 236.09,102.23 243.71,109.86
N$50
  Top 0.813: E36.1 50.04,57.78 50.04,79.38 IC37.4
N$51
  Bottom 0.813: E8.4 205.61,53.34 E12.13
N$52
  Top 0.813: E38.10 53.85,113.67 53.85,117.47 E38.13
N$53
  Top 0.813: E38.8 50.04,112.39 50.04,120.02 E38.1
N$54
  Bottom 0.813: E41.9 36.07,109.86 47.5,109.86 E38.6
N$55  (via drill 0.81)
  Top 0.813: E41.5 34.8,104.78 39.88,104.78 v39.88,111.12
  Bottom 0.813: v39.88,111.12 43.05,114.3 E38.4
N$56
  Top 0.813: IC37.2 46.23,88.27 46.23,114.94 E38.3
N$57  (via drill 0.81)
  Top 0.813: v51.31,76.83 51.31,108.58 E38.5
  Bottom 0.813: v51.31,76.83 IC37.7
N$58  (via drill 0.81)
  Top 0.813: v58.93,76.83 58.93,111.12 E38.11
  Bottom 0.813: v58.93,76.83 IC37.10
N$59
  Top 0.813: IC37.15 57.66,88.27 57.66,107.31 E38.9
N$60
  Top 0.813: IC43.2 5.59,88.27 5.59,109.86 E44.5
N$61  (via drill 0.81)
  Top 0.813: v18.29,76.83 18.29,116.2 E44.13
  Bottom 0.813: v18.29,76.83 IC43.10
N$62
  Top 0.813: IC43.15 17.02,88.27 17.02,112.39 E44.11
N$63  (via drill 0.81)
  Top 0.813: v11.94,78.11 11.94,106.05 E44.9
  Bottom 0.813: v11.94,78.11 IC43.7
N$64
  Bottom 0.813: E41.3 E44.12
N$65
  Bottom 0.813: E44.10 13.21,113.67 13.21,123.83 25.91,123.83 E41.1
N$66
  Bottom 0.813: E44.8 17.02,104.78 27.81,104.78 33.53,110.49 33.53,114.3 E41.11
N$67
  Bottom 0.813: E44.6 11.94,113.67 11.94,125.09 29.08,125.09 34.8,119.38 E41.13
N$68
  Top 0.813: D1.C 168.78,194.31 D2.A
N$69  (via drill 0.81)
  Top 0.813: v244.35,97.16 241.81,94.61 v241.81,92.08 | v213.87,92.08 213.87,79.38 E9.6
  Bottom 0.813: E9.6 E13.9 | E3.9 246.89,97.16 v244.35,97.16 | v213.87,92.08 v241.81,92.08
N$70
  Top 0.813: E9.10 216.41,80.64 216.41,84.45 E9.13
  Bottom 0.813: E9.10 217.04,80.01 211.96,80.01 E9.4 | R41.1 E9.13 213.23,86.36 E9.1
N$71  (via drill 0.81)
  Top 0.813: E1.9 E1.10 262.13,48.9 262.13,90.17 v258.95,93.34 260.86,95.25 260.86,109.86 E3.10 | E5.1 234.82,92.71 v234.82,93.34
  Bottom 0.813: v258.95,93.34 v234.82,93.34
N$72
  Top 0.813: C62.1 238.63,48.26 R38.2
  Bottom 0.813: E1.4 244.98,54.61 R38.2
N$73  (via drill 0.81)
  Top 0.813: R38.1 v235.46,41.27
  Bottom 0.813: E8.8 218.95,41.27 v235.46,41.27
N$74
  Bottom 0.813: E8.9 218.95,42.55 241.81,42.55 244.98,45.72 E1.5 253.87,45.72 E1.8
N$75
  Top 0.813: R35.2 235.46,32.38 235.46,31.75 242.44,24.77 248.79,24.77 | C61.1 248.79,24.77 | E1.11 255.78,45.09 255.78,31.75 248.79,24.77
N$76
  Top 0.813: 229.11,52.7 231.01,50.8 C60.1 | 229.11,52.7 R34.2 | E5.2 229.11,84.45 229.11,52.7
N$77
  Bottom 0.813: R23.2 117.98,199.39 Q3.2
N$78  (via drill 0.81)
  Top 0.813: E12.6 193.55,46.35 v193.55,59.05
  Bottom 0.813: v193.55,59.05 207.52,59.05 E8.1
N$79  (via drill 0.81)
  Top 0.813: E22.8 157.99,106.05 157.99,103.5 159.26,102.23 v164.34,102.23 | v187.2,101.6 187.2,113.67 E14.3
  Bottom 0.813: v164.34,102.23 164.97,101.6 v187.2,101.6
N$80  (via drill 0.81)
  Top 0.813: v182.75,102.87 184.66,104.78 v184.66,116.2
  Bottom 0.813: E22.6 154.18,104.78 168.15,104.78 170.05,102.87 v182.75,102.87 | E14.1 v184.66,116.2
N$81  (via drill 0.81)
  Top 0.813: E10.10 216.41,113.67 216.41,114.94 E10.12 | E14.2 192.28,121.28 192.28,123.83 191.01,125.09 184.66,125.09 v184.66,133.99 184.66,144.15 R14.1 | v213.87,133.99 v213.87,121.28
  Bottom 0.813: v213.87,121.28 E10.12 | v184.66,133.99 v213.87,133.99
N$82  (via drill 0.81)
  Top 0.813: v234.82,198.75 230.38,194.31 230.38,186.69 234.19,182.88 v234.19,156.84
  Bottom 0.813: E7.5 236.73,150.5 236.73,156.84 | 236.73,156.84 238.63,156.84 250.7,144.78 E4.5 | v234.82,198.75 R15.1 | 236.73,156.84 v234.19,156.84
N$84
  Bottom 0.813: E4.11 260.86,149.22 260.86,168.91 258.95,168.91 | C52.+ 258.95,168.91 | 258.95,168.91 R16.1
N$85
  Top 0.813: E7.10 235.46,147.96 235.46,177.16 C53.-
N$86
  Top 0.813: E7.11 236.73,149.22 236.73,172.09 R17.1
  Bottom 0.813: C53.+ 242.44,173.99 R17.1
N$88  (via drill 0.81)
  Top 0.813: v244.98,166.37 243.71,165.1 R18.2
  Bottom 0.813: E6.12 236.73,118.75 236.73,123.83 241.81,123.83 R18.2 | C32.1 246.25,166.37 v244.98,166.37
N$89
  Top 0.813: E7.1 232.92,153.03 232.92,125.09 E6.13
N$90  (via drill 0.81)
  Top 0.813: E35.1 E35.2 | E5.12 236.73,81.92 v236.73,67.94 | v93.22,123.83 97.66,128.27 97.66,144.78 119.89,167 v119.89,170.18 | v198.63,177.16 202.44,173.35 v202.44,130.18 | v249.43,127.64 249.43,90.81 v248.16,89.53
  Bottom 0.813: v236.73,67.94 248.16,67.94 250.7,70.48 255.78,70.48 E2.8 | E35.1 70.36,123.83 v93.22,123.83 | v119.89,170.18 125.6,175.9 137.67,175.9 138.94,177.16 v198.63,177.16 | v202.44,130.18 204.98,127.64 v249.43,127.64 | v248.16,89.53 242.44,83.82 E5.12
N$91
  Top 0.813: D6.A 105.92,185.42 105.92,194.94 R32.2 112.9,203.84 127.51,203.84 131.95,199.39 Q6.2
  Bottom 0.813: Q6.2 135.13,201.29 147.83,201.29 Q5.3 | D7.C 99.57,182.25 102.74,182.25 D6.A
N$92
  Top 0.813: R20.2 180.85,198.75 180.85,196.85 183.39,194.31 Q1.2
N$93
  Top 0.813: E17.11 179.58,83.19 179.58,111.76 180.85,113.03 180.85,141.6 179.58,142.88 | E19.10 179.58,142.88 | C54.- 175.77,186.06 175.77,191.77 177.67,193.68 179.58,193.68 179.58,142.88
N$94
  Bottom 0.813: Q1.3 191.01,200.03 193.55,200.03 R21.2
N$95
  Top 0.813: 199.26,195.58 200.53,196.85 C57.- | 199.26,195.58 R21.1 | 199.26,195.58 R22.1
  Bottom 0.813: R50.2 218.95,197.49 213.87,197.49 Q2.2 211.96,198.12 204.34,198.12 C57.-
N$96  (via drill 0.81)
  Top 0.813: v227.2,195.58 R50.1
  Bottom 0.813: R27.2 v227.2,195.58
N$97
  Top 0.813: R31.1 W1.1 R26.1 W2.1
  Bottom 0.813: Q2.1 210.69,199.39 R19.1 206.25,203.84 112.9,203.84 107.82,198.75 97.66,198.75 W2.1
N$98
  Bottom 0.813: R31.2 90.68,203.84 95.76,203.84 | W2.2 95.76,203.84 | R45.1 105.92,203.84 95.76,203.84
N$99
  Bottom 0.813: Q3.1 127.51,194.94 140.21,194.94 Q4.3
N$100  (via drill 0.81)
  Top 0.813: E19.11 175.13,149.86 v175.13,170.18 175.13,177.8 R30.1
  Bottom 0.813: v175.13,170.18 C54.+
N$101
  Bottom 0.813: R52.1 165.61,137.79 170.05,137.79 171.96,139.7 171.96,144.78 E19.5
N$102  (via drill 0.81)
  Top 0.813: v101.47,172.09 98.3,175.26 v98.3,188.59
  Bottom 0.813: v101.47,172.09 C58.+ | v98.3,188.59 98.3,190.5 101.47,193.68 102.11,193.68 R25.2 107.19,194.94 120.52,194.94 128.14,202.56 151.64,202.56 Q5.2
N$103  (via drill 0.81)
  Top 0.813: v107.82,173.35 109.73,175.26 109.73,189.87 R45.2
  Bottom 0.813: v107.82,173.35 C59.+ | Q4.2 144.65,193.68 109.73,193.68 R45.2
N$104  (via drill 0.81)
  Top 0.813: D4.C 97.03,177.16 97.03,189.23 99.57,191.77 | 99.57,191.77 101.47,193.68 v101.47,196.85 R24.2 | C58.- 99.57,186.06 99.57,191.77
  Bottom 0.813: v101.47,196.85 Q3.3
N$105  (via drill 0.81)
  Top 0.813: v108.46,175.9 107.82,176.53 C59.-
  Bottom 0.813: R44.1 109.73,175.9 v108.46,175.9
N$106  (via drill 0.81)
  Top 0.813: E19.3 E19.4 | E26.2 133.86,123.83 v133.86,153.67
  Bottom 0.813: v133.86,153.67 135.13,154.94 E23.1 154.81,154.94 E23.13 167.51,152.4 E19.3
N$107
  Top 0.813: E17.13 174.5,89.53 174.5,132.72 171.96,135.25 171.96,140.34 E19.6
  Bottom 0.813: E19.6 E23.9
N$108
  Top 0.813: C22.1 160.53,133.99 160.53,145.41 R51.2
  Bottom 0.813: E23.12 159.89,147.32 R51.2
N$109  (via drill 0.81)
  Top 0.813: E17.12 174.5,80.64 171.96,80.64 v171.96,96.52 | v166.88,164.47 v166.88,97.79 | v245.62,164.47 246.89,164.47 249.43,161.93 v249.43,136.53 | v258.32,132.72 260.86,130.18 260.86,118.75 E3.12